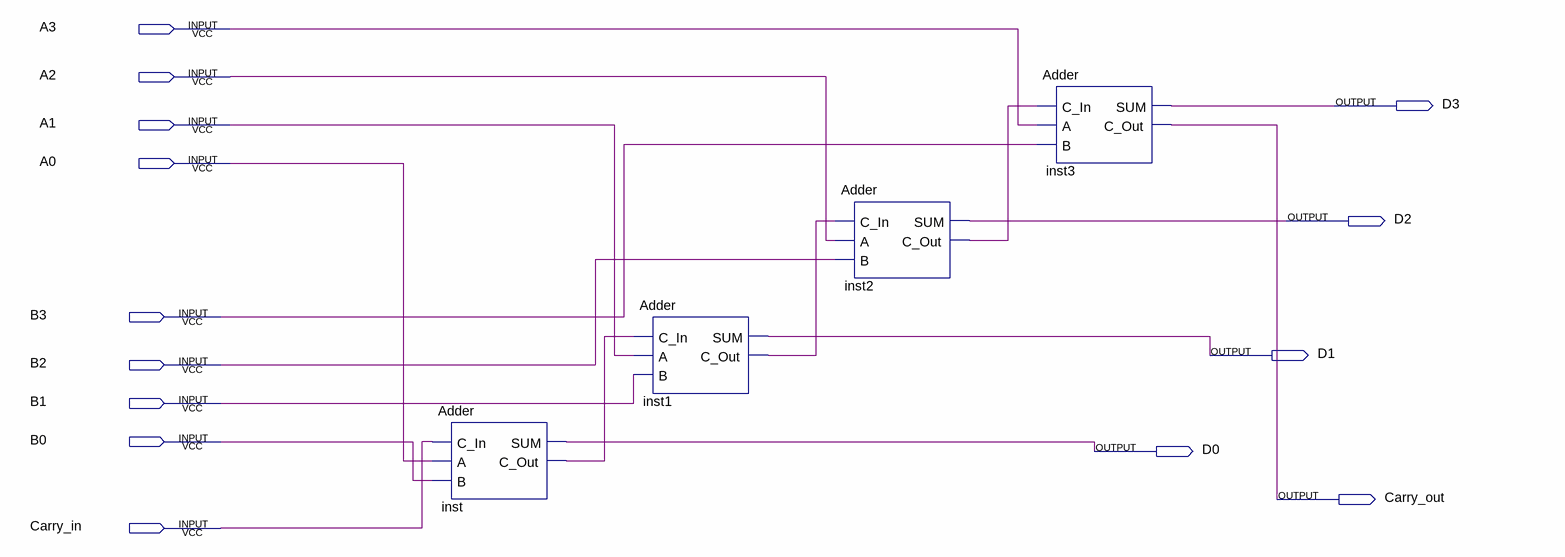
[diagram p0: schematic sheet]
// Quartus schematic 4bit_Adder.bdf as structural Verilog: 4 symbols, 14 pins
module \4bit_Adder  (
  input  A3,
  input  A2,
  input  A1,
  input  A0,
  input  B3,
  input  B2,
  input  B1,
  input  B0,
  input  Carry_in,
  output D3,
  output D2,
  output D1,
  output D0,
  output Carry_out
);

  wire inst1_c_out, inst2_c_out, inst_c_out;

  Adder inst (.C_In(Carry_in), .A(A0), .B(B0), .SUM(D0), .C_Out(inst_c_out));
  Adder inst1 (.C_In(inst_c_out), .A(A1), .B(B1), .SUM(D1), .C_Out(inst1_c_out));
  Adder inst2 (.C_In(inst1_c_out), .A(A2), .B(B2), .SUM(D2), .C_Out(inst2_c_out));
  Adder inst3 (.C_In(inst2_c_out), .A(A3), .B(B3), .SUM(D3), .C_Out(Carry_out));
endmodule
